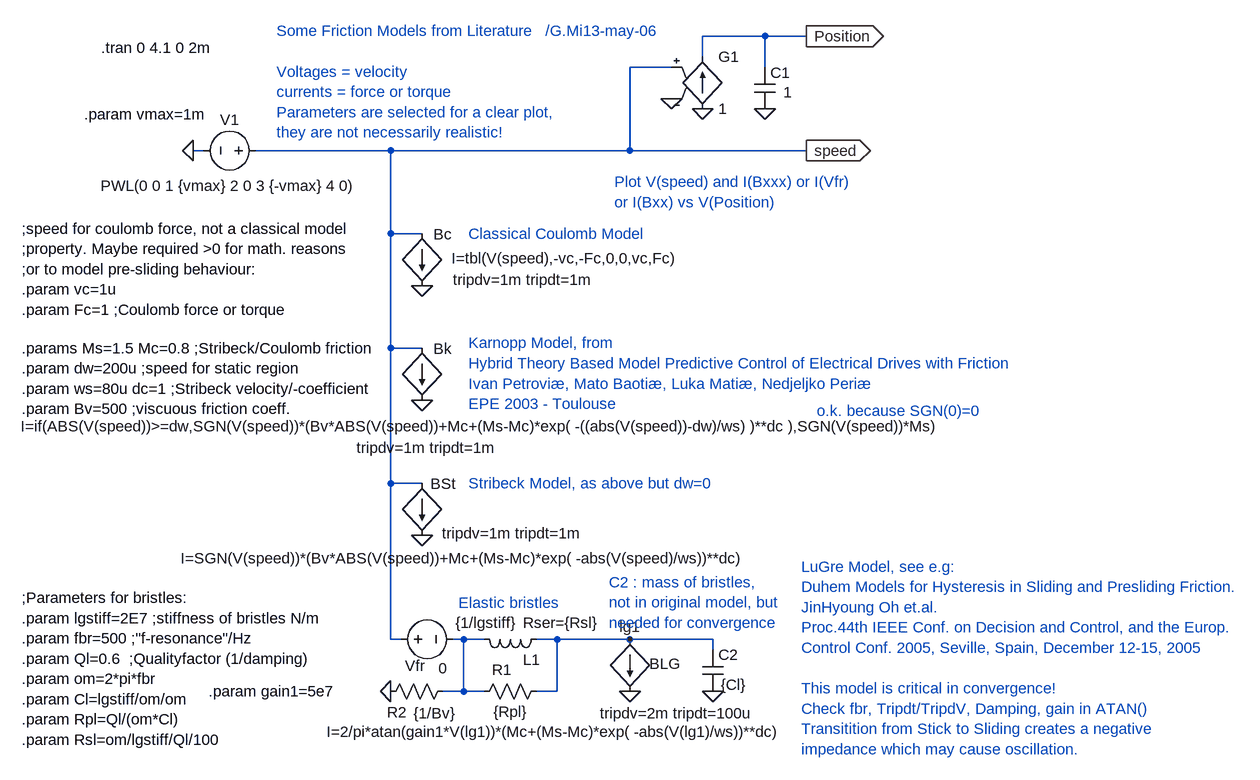
[diagram p0: schematic friction_models_literature.asc]
friction_models_literature.asc, the LTspice schematic file:
Version 4
SHEET 1 1532 1224
WIRE -288 48 -304 48
WIRE 0 48 -208 48
WIRE 0 176 0 48
WIRE 0 352 0 176
WIRE 0 560 0 352
WIRE 0 800 0 560
WIRE 16 800 0 800
WIRE 48 176 0 176
WIRE 48 352 0 352
WIRE 48 560 0 560
WIRE 112 800 96 800
WIRE 112 880 80 880
WIRE 112 880 112 800
WIRE 144 800 112 800
WIRE 144 880 112 880
WIRE 256 800 224 800
WIRE 256 880 224 880
WIRE 256 880 256 800
WIRE 368 48 0 48
WIRE 368 48 368 -80
WIRE 368 800 256 800
WIRE 432 -80 368 -80
WIRE 480 -96 480 -128
WIRE 496 800 368 800
WIRE 496 816 496 800
WIRE 576 -128 480 -128
WIRE 576 -80 576 -128
WIRE 640 -128 576 -128
WIRE 640 48 368 48
FLAG -304 48 0
FLAG 48 432 0
FLAG 640 48 speed
IOPIN 640 48 Out
FLAG 48 256 0
FLAG 48 640 0
FLAG 480 -16 0
FLAG 432 -32 0
FLAG 640 -128 Position
IOPIN 640 -128 Out
FLAG 576 -16 0
FLAG 368 880 0
FLAG 368 800 lg1
FLAG 496 880 0
FLAG 0 880 0
SYMBOL voltage -192 48 M270
WINDOW 0 32 56 VTop 0
WINDOW 3 -54 -139 VRight 0
WINDOW 123 0 0 Left 0
WINDOW 39 -82 -139 VRight 0
SYMATTR InstName V1
SYMATTR Value PWL(0 0 1 {vmax} 2 0 3 {-vmax} 4 0)
SYMBOL bi 48 352 R0
WINDOW 0 32 -15 Top 0
WINDOW 3 98 136 Bottom 0
WINDOW 123 7 169 Bottom 0
SYMATTR InstName Bk
SYMATTR Value I=if(ABS(V(speed))>=dw,SGN(V(speed))*(Bv*ABS(V(speed))+Mc+(Ms-Mc)*exp( -((abs(V(speed))-dw)/ws) )**dc ),SGN(V(speed))*Ms)
SYMATTR Value2 tripdv=1m tripdt=1m
SYMBOL bi 48 176 R0
WINDOW 0 32 -15 Top 0
WINDOW 3 219 53 Bottom 0
WINDOW 123 156 86 Bottom 0
SYMATTR InstName Bc
SYMATTR Value I=tbl(V(speed),-vc,-Fc,0,0,vc,Fc)
SYMATTR Value2 tripdv=1m tripdt=1m
SYMBOL bi 48 560 R0
WINDOW 0 32 -15 Top 0
WINDOW 3 66 131 Bottom 0
WINDOW 123 139 92 Bottom 0
SYMATTR InstName BSt
SYMATTR Value I=SGN(V(speed))*(Bv*ABS(V(speed))+Mc+(Ms-Mc)*exp( -abs(V(speed)/ws))**dc)
SYMATTR Value2 tripdv=1m tripdt=1m
SYMBOL g 480 -112 R0
SYMATTR InstName G1
SYMATTR Value 1
SYMBOL cap 560 -80 R0
WINDOW 3 44 38 Left 0
SYMATTR Value 1
SYMATTR InstName C1
SYMBOL bi 368 800 R0
WINDOW 0 54 22 Top 0
WINDOW 3 -114 158 Bottom 0
WINDOW 123 72 129 Bottom 0
SYMATTR InstName BLG
SYMATTR Value I=2/pi*atan(gain1*V(lg1))*(Mc+(Ms-Mc)*exp( -abs(V(lg1)/ws))**dc)
SYMATTR Value2 tripdv=2m tripdt=100u
SYMBOL ind 240 784 R90
WINDOW 0 63 23 VBottom 0
WINDOW 3 -25 94 VTop 0
WINDOW 39 -25 -22 VTop 0
SYMATTR InstName L1
SYMATTR Value {1/lgstiff}
SYMATTR SpiceLine Rser={Rsl}
SYMBOL cap 480 816 R0
WINDOW 3 28 54 Left 0
SYMATTR Value {Cl}
SYMATTR InstName C2
SYMBOL res 240 864 R90
WINDOW 0 -2 69 VBottom 0
WINDOW 3 32 56 VTop 0
SYMATTR InstName R1
SYMATTR Value {Rpl}
SYMBOL res 96 864 R90
WINDOW 0 64 86 VBottom 0
WINDOW 3 34 29 VTop 0
SYMATTR InstName R2
SYMATTR Value {1/Bv}
SYMBOL voltage 0 800 R270
WINDOW 0 -56 37 VTop 0
WINDOW 3 -29 80 VBottom 0
SYMATTR InstName Vfr
SYMATTR Value 0
TEXT -446 -110 Left 0 !.tran 0 4.1 0 2m
TEXT -176 -136 Left 0 ;Some Friction Models from Literature   /G.Mi13-may-06\n \nVoltages = velocity\ncurrents = force or torque\nParameters are selected for a clear plot,\nthey are not necessarily realistic!
TEXT -568 352 Left 0 !.params Ms=1.5 Mc=0.8 ;Stribeck/Coulomb friction\n.param dw=200u ;speed for static region\n.param ws=80u dc=1 ;Stribeck velocity/-coefficient\n.param Bv=500 ;viscuous friction coeff.
TEXT 120 344 Left 0 ;Karnopp Model, from\nHybrid Theory Based Model Predictive Control of Electrical Drives with Friction\nIvan Petroviæ, Mato Baotiæ, Luka Matiæ, Nedjeljko Periæ\nEPE 2003 - Toulouse
TEXT 120 176 Left 0 ;Classical Coulomb Model
TEXT -568 168 Left 0 !;speed for coulomb force, not a classical model\n;property. Maybe required >0 for math. reasons\n;or to model pre-sliding behaviour:\n.param vc=1u\n.param Fc=1 ;Coulomb force or torque
TEXT 632 688 Left 0 ;LuGre Model, see e.g:\nDuhem Models for Hysteresis in Sliding and Presliding Friction.\nJinHyoung Oh et.al.\nProc.44th IEEE Conf. on Decision and Control, and the Europ.\nControl Conf. 2005, Seville, Spain, December 12-15, 2005\n \nThis model is critical in convergence!\nCheck fbr, Tripdt/TripdV, Damping, gain in ATAN()\nTransitition from Stick to Sliding creates a negative\nimpedance which may cause oscillation.
TEXT 344 96 Left 0 ;Plot V(speed) and I(Bxxx) or I(Vfr)\nor I(Bxx) vs V(Position)
TEXT 120 560 Left 0 ;Stribeck Model, as above but dw=0
TEXT 656 448 Left 0 ;o.k. because SGN(0)=0
TEXT 336 712 Left 0 ;C2 : mass of bristles,\nnot in original model, but\nneeded for convergence
TEXT -472 -8 Left 0 !.param vmax=1m
TEXT -568 736 Left 0 !;Parameters for bristles:\n.param lgstiff=2E7 ;stiffness of bristles N/m\n.param fbr=500 ;"f-resonance"/Hz\n.param Ql=0.6  ;Qualityfactor (1/damping)\n.param om=2*pi*fbr\n.param Cl=lgstiff/om/om\n.param Rpl=Ql/(om*Cl)\n.param Rsl=om/lgstiff/Ql/100
TEXT -280 880 Left 0 !.param gain1=5e7
TEXT 104 744 Left 0 ;Elastic bristles

The netlist it stands for:
* friction_models_literature.asc
V1 speed 0 PWL(0 0 1 {vmax} 2 0 3 {-vmax} 4 0)
Bk speed 0 I=if(ABS(V(speed))>=dw,SGN(V(speed))*(Bv*ABS(V(speed))+Mc+(Ms-Mc)*exp( -((abs(V(speed))-dw)/ws) )**dc ),SGN(V(speed))*Ms) tripdv=1m tripdt=1m
Bc speed 0 I=tbl(V(speed),-vc,-Fc,0,0,vc,Fc) tripdv=1m tripdt=1m
BSt speed 0 I=SGN(V(speed))*(Bv*ABS(V(speed))+Mc+(Ms-Mc)*exp( -abs(V(speed)/ws))**dc) tripdv=1m tripdt=1m
G1 0 Position speed 0 1
C1 Position 0 1
BLG lg1 0 I=2/pi*atan(gain1*V(lg1))*(Mc+(Ms-Mc)*exp( -abs(V(lg1)/ws))**dc) tripdv=2m tripdt=100u
L1 lg1 N001 {1/lgstiff} Rser={Rsl}
C2 lg1 0 {Cl}
R1 lg1 N001 {Rpl}
R2 N001 0 {1/Bv}
Vfr speed N001 0
.tran 0 4.1 0 2m
* Some Friction Models from Literature   /G.Mi13-may-06
* Voltages = velocity
* currents = force or torque
* Parameters are selected for a clear plot,
* they are not necessarily realistic!
.params Ms=1.5 Mc=0.8 ;Stribeck/Coulomb friction
.param dw=200u ;speed for static region
.param ws=80u dc=1 ;Stribeck velocity/-coefficient
.param Bv=500 ;viscuous friction coeff.
* Karnopp Model, from
* Hybrid Theory Based Model Predictive Control of Electrical Drives with Friction
* Ivan Petroviæ, Mato Baotiæ, Luka Matiæ, Nedjeljko Periæ
* EPE 2003 - Toulouse
* Classical Coulomb Model
;speed for coulomb force, not a classical model
;property. Maybe required >0 for math. reasons
;or to model pre-sliding behaviour:
.param vc=1u
.param Fc=1 ;Coulomb force or torque
* LuGre Model, see e.g:
* Duhem Models for Hysteresis in Sliding and Presliding Friction.
* JinHyoung Oh et.al.
* Proc.44th IEEE Conf. on Decision and Control, and the Europ.
* Control Conf. 2005, Seville, Spain, December 12-15, 2005
* This model is critical in convergence!
* Check fbr, Tripdt/TripdV, Damping, gain in ATAN()
* Transitition from Stick to Sliding creates a negative
* impedance which may cause oscillation.
* Plot V(speed) and I(Bxxx) or I(Vfr)
* or I(Bxx) vs V(Position)
* Stribeck Model, as above but dw=0
* o.k. because SGN(0)=0
* C2 : mass of bristles,
* not in original model, but
* needed for convergence
.param vmax=1m
;Parameters for bristles:
.param lgstiff=2E7 ;stiffness of bristles N/m
.param fbr=500 ;"f-resonance"/Hz
.param Ql=0.6  ;Qualityfactor (1/damping)
.param om=2*pi*fbr
.param Cl=lgstiff/om/om
.param Rpl=Ql/(om*Cl)
.param Rsl=om/lgstiff/Ql/100
.param gain1=5e7
* Elastic bristles
.backanno
.end